# EasyEDA Pro project ProPrj_ArpiGlasses_Final2_2025-06-16.epro, schematic ArpiGlasses
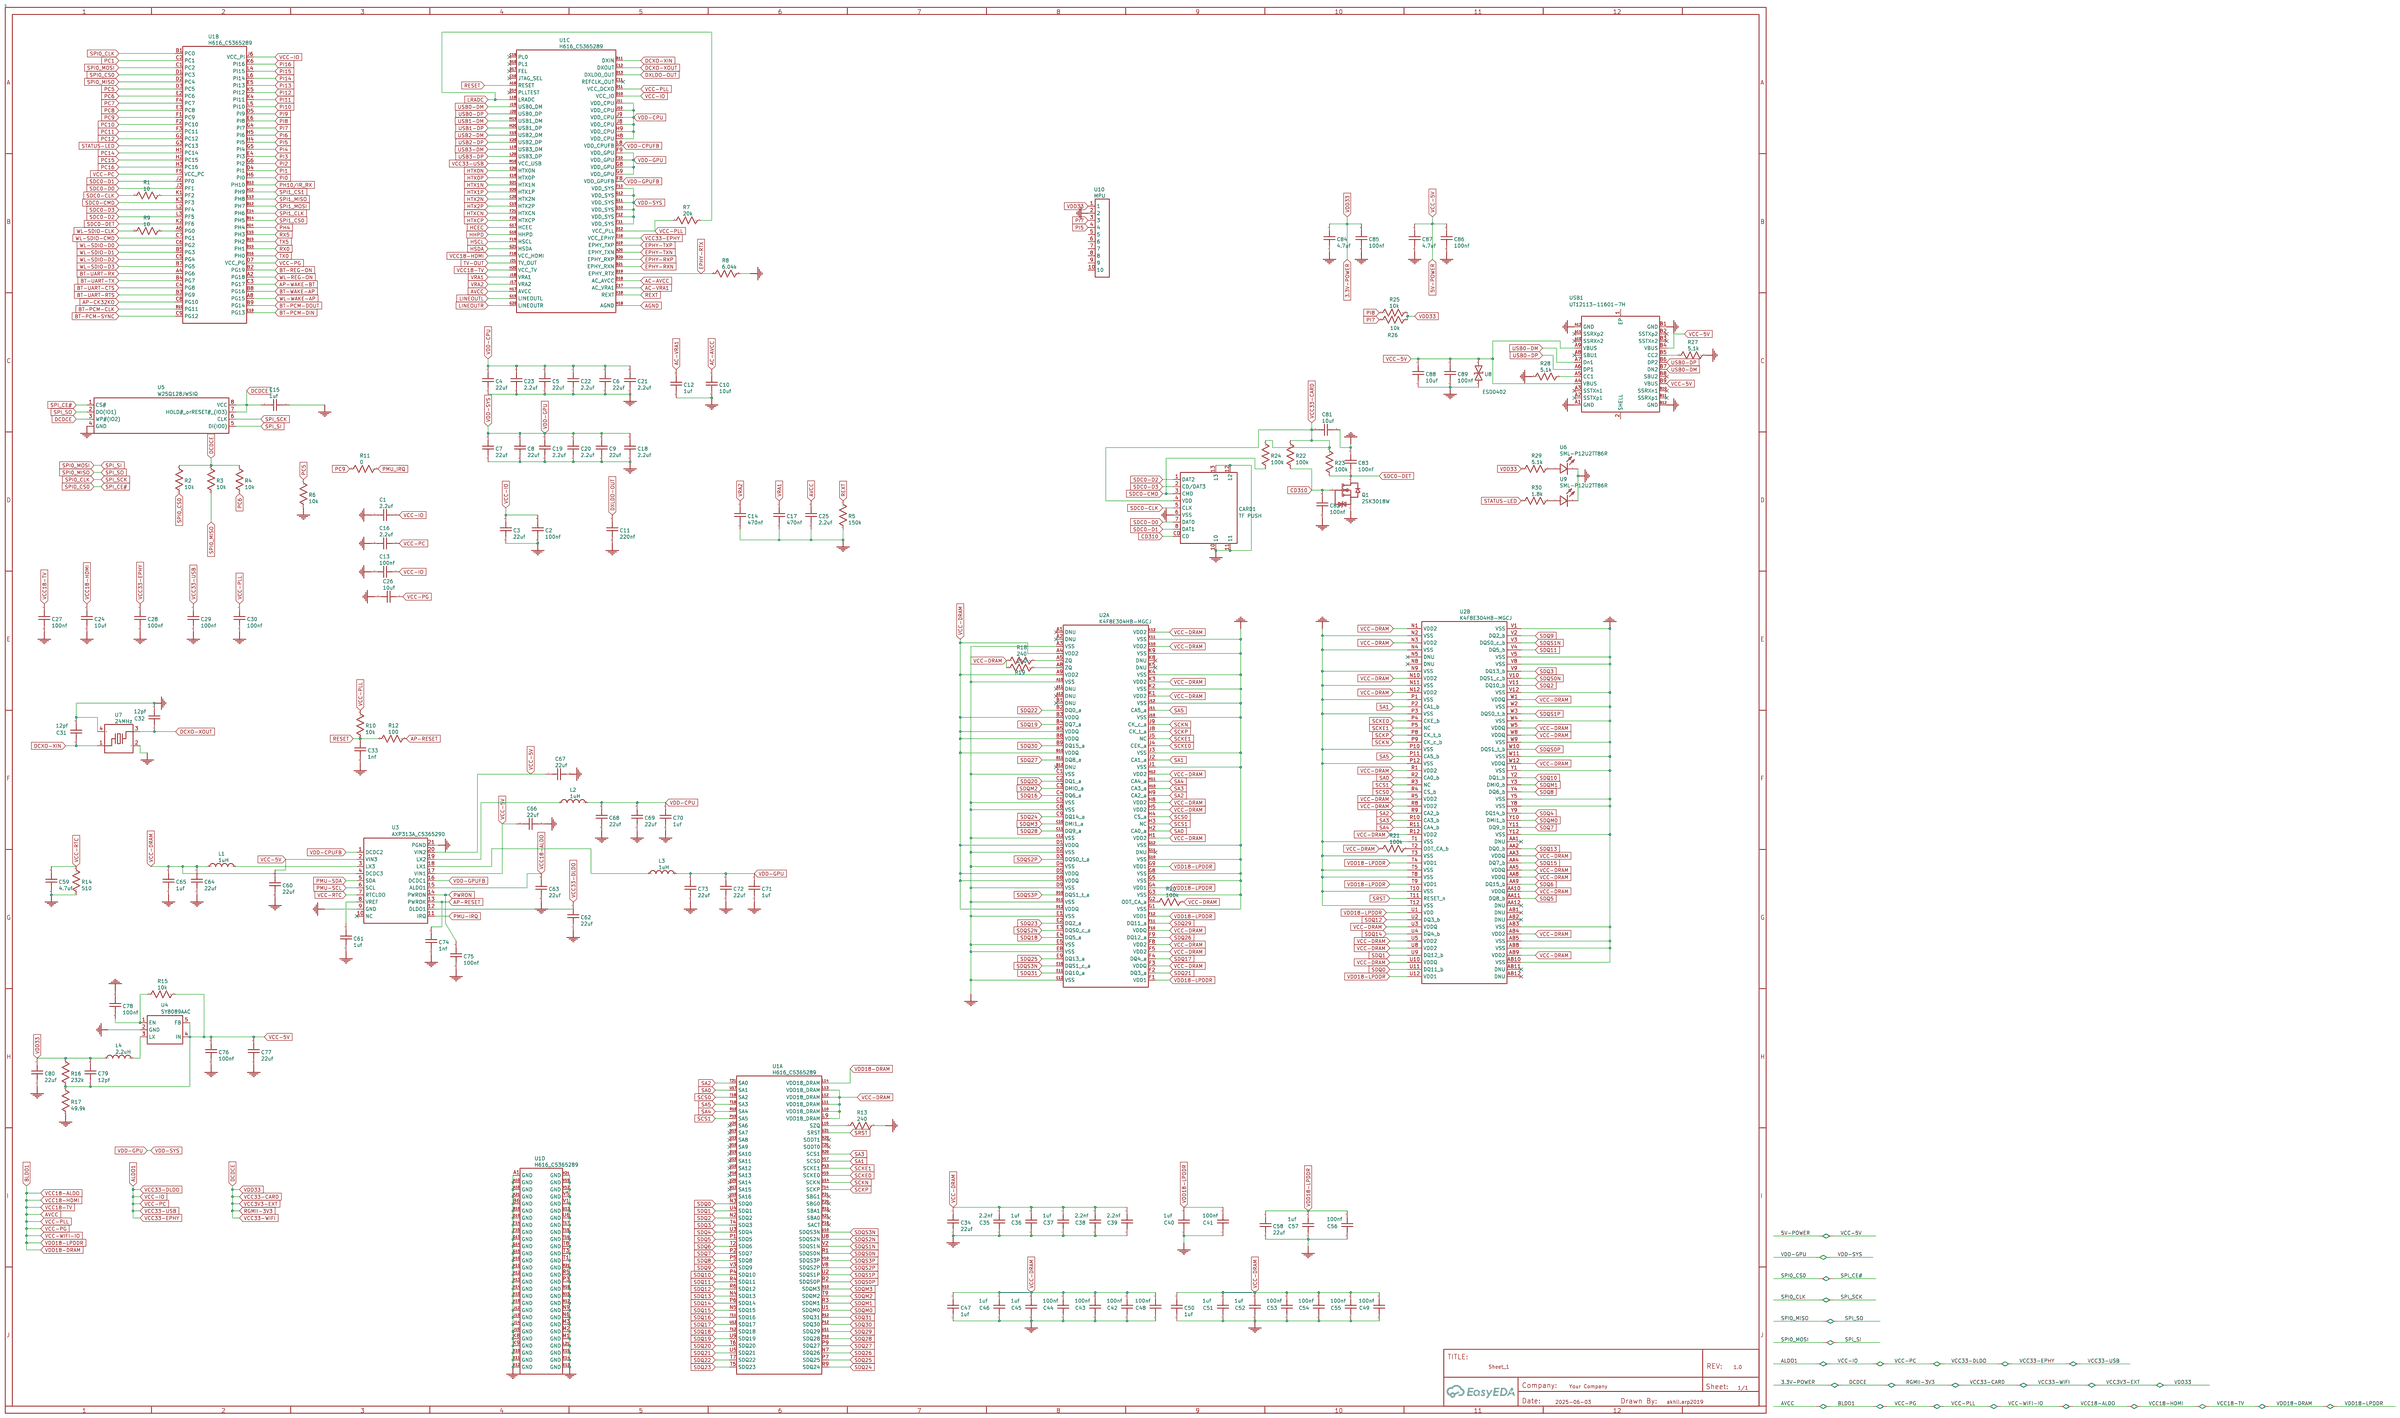
[diagram p0: schematic sheet]

## Parts
C1  2.2uf  [C0603]
C2  100nf  [C0603]
C3  22uf  [C0603]
C4  22uf  [C0603]
C5  22uf  [C0603]
C6  22uf  [C0603]
C7  22uf  [C0603]
C8  22uf  [C0603]
C9  22uf  [C0603]
C10  10uf  [C0603]
C11  220nf  [C0603]
C12  1uf  [C0603]
C13  100nf  [C0603]
C14  470nf  [C0603]
C15  1uf  [C0603]
C16  2.2uf  [C0603]
C17  470nf  [C0603]
C18  2.2uf  [C0603]
C19  2.2uf  [C0603]
C20  2.2uf  [C0603]
C21  2.2uf  [C0603]
C22  2.2uf  [C0603]
C23  2.2uf  [C0603]
C24  10uf  [C0603]
C25  2.2uf  [C0603]
C26  10uf  [C0603]
C27  100nf  [C0603]
C28  100nf  [C0603]
C29  100nf  [C0603]
C30  100nf  [C0603]
C31  12pf  [C0603]
C32  12pf  [C0603]
C33  1nf  [C0603]
C34  22uf  [C0603]
C35  2.2nf  [C0603]
C36  1uf  [C0603]
C37  1uf  [C0603]
C38  2.2nf  [C0603]
C39  2.2nf  [C0603]
C40  1uf  [C0603]
C41  100nf  [C0603]
C42  100nf  [C0603]
C43  100nf  [C0603]
C44  100nf  [C0603]
C45  1uf  [C0603]
C46  1uf  [C0603]
C47  1uf  [C0603]
C48  100nf  [C0603]
C49  100nf  [C0603]
C50  1uf  [C0603]
C51  1uf  [C0603]
C52  1uf  [C0603]
C53  100nf  [C0603]
C54  100nf  [C0603]
C55  100nf  [C0603]
C56  100nf  [C0603]
C57  1uf  [C0603]
C58  22uf  [C0603]
C59  4.7uf  [C0603]
C60  22uf  [C0603]
C61  1uf  [C0603]
C62  22uf  [C0603]
C63  22uf  [C0603]
C64  22uf  [C0603]
C65  1uf  [C0603]
C66  22uf  [C0603]
C67  22uf  [C0603]
C68  22uf  [C0603]
C69  22uf  [C0603]
C70  1uf  [C0603]
C71  1uf  [C0603]
C72  22uf  [C0603]
C73  22uf  [C0603]
C74  1nf  [C0603]
C75  100nf  [C0603]
C76  100nf  [C0603]
C77  22uf  [C0603]
C78  100nf  [C0603]
C79  12pf  [C0603]
C80  22uf  [C0603]
C81  10uf  [C0603]
C82  100nf  [C0603]
C83  100nf  [C0603]
C84  4.7uf  [C0603]
C85  100nf  [C0603]
C86  100nf  [C0603]
C87  4.7uf  [C0603]
C88  10uf  [C0603]
C89  100nf  [C0603]
CARD1  TF PUSH  [TF-SMD_TF-PUSH]
L1  1uH  [IND-SMD_L2.5-W2.0_AHP252010X]
L2  1uH  [IND-SMD_L2.5-W2.0_AHP252010X]
L3  1uH  [IND-SMD_L2.5-W2.0_AHP252010X]
L4  2.2uH  [IND-SMD_L2.5-W2.0_WPN252012H]
Q1  2SK3018W  [SOT-323_L2.0-W1.3-P1.30-LS2.1-TR]
R1  10  [R0603]
R2  10k  [R0603]
R3  10k  [R0603]
R4  10k  [R0603]
R5  150k  [R0603]
R6  10k  [R0603]
R7  20k  [R0603]
R8  6.04k  [R0603]
R9  10  [R0603]
R10  10k  [R0603]
R11  0  [R0603]
R12  100  [R0603]
R13  240  [R0603]
R14  510  [R0603]
R15  10k  [R0603]
R16  232k  [R0603]
R17  49.9k  [R0603]
R18  240  [R0603]
R19  240  [R0603]
R20  100k  [R0603]
R21  100k  [R0603]
R22  100k  [R0603]
R23  100k  [R0603]
R24  100k  [R0603]
R25  10k  [R0603]
R26  10k  [R0603]
R27  5.1k  [R0603]
R28  5.1k  [R0603]
R29  5.1k  [R0603]
R30  1.8k  [R0603]
U1  H616_C5365289  [BGA-284_L14.0-W12.0-P0.65-TL]  (sections 1,2,3,4)
U2  K4F8E304HB-MGCJ  [BGA-200_L15.0-W10.0_K4F8E304HB-MGCJ]  (sections 1,2)
U3  AXP313A_C5365290  [QFN-20_L3.0-W3.0-P0.40-BL-EP1.7]
U4  SY8089AAC  [SOT-23-5_L2.9-W1.6-P0.95-LS2.8-BL]
U5  W25Q128JWSIQ  [SOIC-8_L5.3-W5.3-P1.27-LS8.0-BL]
U6  SML-P12U2TT86R  [LED0402-R-RD]
U7  24MHz  [CRYSTAL-SMD_4P-L2.0-W1.6-BL-2]
U8  ESD0402  [D0402-BI]
U9  SML-P12U2TT86R  [LED0402-R-RD]
U10  MPU  [PIN HEADER 1X10PIN 2.54MM 10P]
USB1  UT12113-11601-7H  [USB-C-SMD_UT12113-11601-7H]

## Library data of the parts
C1 C16 C18-C23 C25 = 2.2uf: nameAlias: Value(F); Contributor: LCEDA_Lib; spicePre: C; spiceSymbolName: C_0603_US
C2 C13 C27-C30 C41-C44 C48 C49 C53-C56 C75 C76 C78 C82 C83 C85 C86 C89 = 100nf: nameAlias: Value(F); Contributor: LCEDA_Lib; spicePre: C; spiceSymbolName: C_0603_US
C3-C9 C34 C58 C60 C62-C64 C66-C69 C72 C73 C77 C80 = 22uf: nameAlias: Value(F); Contributor: LCEDA_Lib; spicePre: C; spiceSymbolName: C_0603_US
C10 C24 C26 C81 C88 = 10uf: nameAlias: Value(F); Contributor: LCEDA_Lib; spicePre: C; spiceSymbolName: C_0603_US
C11 = 220nf: nameAlias: Value(F); Contributor: LCEDA_Lib; spicePre: C; spiceSymbolName: C_0603_US
C12 C15 C36 C37 C40 C45-C47 C50-C52 C57 C61 C65 C70 C71 = 1uf: nameAlias: Value(F); Contributor: LCEDA_Lib; spicePre: C; spiceSymbolName: C_0603_US
C14 C17 = 470nf: nameAlias: Value(F); Contributor: LCEDA_Lib; spicePre: C; spiceSymbolName: C_0603_US
C31 C32 C79 = 12pf: nameAlias: Value(F); Contributor: LCEDA_Lib; spicePre: C; spiceSymbolName: C_0603_US
C33 C74 = 1nf: nameAlias: Value(F); Contributor: LCEDA_Lib; spicePre: C; spiceSymbolName: C_0603_US
C35 C38 C39 = 2.2nf: nameAlias: Value(F); Contributor: LCEDA_Lib; spicePre: C; spiceSymbolName: C_0603_US
C59 C84 C87 = 4.7uf: nameAlias: Value(F); Contributor: LCEDA_Lib; spicePre: C; spiceSymbolName: C_0603_US
CARD1 = TF PUSH: Supplier: LCSC; Supplier Part: C393941; Manufacturer: SHOU HAN(首韩); JLCPCB Part Class: Extended Part; Contributor: LCSC; spicePre: C
L1-L3 = 1uH: Supplier: LCSC; Manufacturer: Sunlord(顺络); Manufacturer Part: SWPA252012S1R0MT; Supplier Part: C66001; JLCPCB Part Class: Extended Part; nameAlias: Value; spicePre: L; spiceSymbolName: SWPA252012S1R0MT
L4 = 2.2uH: Supplier: LCSC; Manufacturer: Sunlord(顺络); Manufacturer Part: WPN252012H2R2MT; Supplier Part: C98350; JLCPCB Part Class: Extended Part; nameAlias: Value; spicePre: L; spiceSymbolName: WPN252012H2R2MT
Q1 = 2SK3018W: Supplier: LCSC; Supplier Part: C328614; Manufacturer: BLUE ROCKET(蓝箭); JLCPCB Part Class: Extended Part; Contributor: LCSC; spicePre: Q
R1 R9 = 10: nameAlias: Value(Ω); Contributor: LCEDA_Lib; spicePre: R; spiceSymbolName: R_0603_US
R2-R4 R6 R10 R15 R25 R26 = 10k: nameAlias: Value(Ω); Contributor: LCEDA_Lib; spicePre: R; spiceSymbolName: R_0603_US
R5 = 150k: nameAlias: Value(Ω); Contributor: LCEDA_Lib; spicePre: R; spiceSymbolName: R_0603_US
R7 = 20k: nameAlias: Value(Ω); Contributor: LCEDA_Lib; spicePre: R; spiceSymbolName: R_0603_US
R8 = 6.04k: nameAlias: Value(Ω); Contributor: LCEDA_Lib; spicePre: R; spiceSymbolName: R_0603_US
R11 = 0: nameAlias: Value(Ω); Contributor: LCEDA_Lib; spicePre: R; spiceSymbolName: R_0603_US
R12 = 100: nameAlias: Value(Ω); Contributor: LCEDA_Lib; spicePre: R; spiceSymbolName: R_0603_US
R13 R18 R19 = 240: nameAlias: Value(Ω); Contributor: LCEDA_Lib; spicePre: R; spiceSymbolName: R_0603_US
R14 = 510: nameAlias: Value(Ω); Contributor: LCEDA_Lib; spicePre: R; spiceSymbolName: R_0603_US
R16 = 232k: nameAlias: Value(Ω); Contributor: LCEDA_Lib; spicePre: R; spiceSymbolName: R_0603_US
R17 = 49.9k: nameAlias: Value(Ω); Contributor: LCEDA_Lib; spicePre: R; spiceSymbolName: R_0603_US
R20-R24 = 100k: nameAlias: Value(Ω); Contributor: LCEDA_Lib; spicePre: R; spiceSymbolName: R_0603_US
R27-R29 = 5.1k: nameAlias: Value(Ω); Contributor: LCEDA_Lib; spicePre: R; spiceSymbolName: R_0603_US
R30 = 1.8k: nameAlias: Value(Ω); Contributor: LCEDA_Lib; spicePre: R; spiceSymbolName: R_0603_US
U1 = H616_C5365289: Supplier: LCSC; Supplier Part: C5365289; Manufacturer: Allwinner(全志); Manufacturer Part: H616; JLCPCB Part Class: Extended Part; subpart_no: 1; spicePre: U
U2 = K4F8E304HB-MGCJ: Supplier: LCSC; Supplier Part: C2803257; Manufacturer: SAMSUNG(三星半导体); JLCPCB Part Class: Extended Part; subpart_no: 1; spicePre: U
U3 = AXP313A_C5365290: Supplier: LCSC; Supplier Part: C5365290; Manufacturer: x-powers; Manufacturer Part: AXP313A; JLCPCB Part Class: Extended Part; Contributor: lcsc; spicePre: U
U4 = SY8089AAC: Supplier: LCSC; Supplier Part: C5187495; Manufacturer: null; JLCPCB Part Class: Extended Part; Contributor: lcsc; spicePre: U
U5 = W25Q128JWSIQ: Supplier: LCSC; Supplier Part: C2763561; Manufacturer: WINBOND(华邦); JLCPCB Part Class: Extended Part; Contributor: LCSC; spicePre: U
U6 U9 = SML-P12U2TT86R: Supplier: LCSC; Supplier Part: C5336694; Manufacturer: ROHM(罗姆); JLCPCB Part Class: Extended Part; Contributor: lcsc; spicePre: U
U7 = 24MHz: Supplier: LCSC; Supplier Part: C5181486; Manufacturer: SST(索斯特); Manufacturer Part: 2016 24M 12PF 10PPM; JLCPCB Part Class: Extended Part; Contributor: lcsc; nameAlias: Value; spicePre: U; spiceSymbolName: 2016 24M 12PF 10PPM
U8 = ESD0402: Supplier: LCSC; Supplier Part: C9900022568; Manufacturer: null; JLCPCB Part Class: Extended Part; Contributor: lcsc; spicePre: U
U10 = MPU: Contributor: FirstZ Kai Zen; spicePre: U; spiceSymbolName: Pin Header 1x10Pin 2.54mm 10P
USB1 = UT12113-11601-7H: Supplier: LCSC; Supplier Part: C2761409; Manufacturer: FOXCONN(富士康); JLCPCB Part Class: Extended Part; Contributor: LCSC; spicePre: U

## Nets
3.3V-POWER: C15.2 C79.2 C80.2 C81.1 C84.2 C85.2 CARD1.4(VDD) L4.1 R2.2 R3.2 R4.2 R16.2 R22.2 R23.2 R24.2 R25.2 R26.2 R29.1 U5.3(WP#(IO2)) U5.7(HOLD# orRESET# (IO3)) U5.8(VCC) U10.1
5V-POWER: C60.2 C66.1 C67.1 C76.2 C77.2 C79.1 C86.2 C87.2 C88.2 C89.2 R15.2 R16.1 R17.2 U3.2(VIN3) U3.17(VIN1) U3.20(VIN2) U4.4(IN) U4.5(FB) U8.1 USB1.A4(VBUS) USB1.A9(VBUS) USB1.B4(VBUS) USB1.B9(VBUS)
AGND: U1.H18(AGND)
AVCC: C24.2 C25.2 C26.1 C27.2 C30.2 C40.2 C41.2 C56.2 C57.2 C58.2 C63.2 R7.2 R10.2 U1.D7(VCC_PG) U1.D11(VCC_DCXO) U1.D12(VCC_PLL) U1.F18(VCC_HDMI) U1.H17(AVCC) U1.H20(VCC_TV) U1.L14(VDD18_DRAM) U2.F1(VDD1) U2.F12(VDD1) U2.G4(VDD1) U2.G9(VDD1) U2.T4(VDD1) U2.T9(VDD1) U2.U1(VDD) U2.U12(VDD1) U3.15(ALDO1)
GND: C1.2 C2.1 C3.1 C4.1 C5.1 C6.1 C7.1 C8.1 C9.1 C10.1 C11.1 C12.1 C13.2 C14.1 C15.1 C16.2 C17.1 C18.1 C19.1 C20.1 C21.1 C22.1 C23.1 C24.1 C25.1 C26.2 C27.1 C28.1 C29.1 C30.1 C31.2 C32.2 C33.1 C34.1 C35.1 C36.1 C37.1 C38.1 C39.1 C40.1 C41.1 C42.1 C43.1 C44.1 C45.1 C46.1 C47.1 C48.1 C49.1 C50.1 C51.1 C52.1 C53.1 C54.1 C55.1 C56.1 C57.1 C58.1 C59.1 C60.1 C61.1 C62.1 C63.1 C64.1 C65.1 C66.2 C67.2 C68.1 C69.1 C70.1 C71.1 C72.1 C73.1 C74.1 C75.1 C76.1 C77.1 C78.1 C80.1 C81.2 C82.1 C83.2 C84.1 C85.1 C86.1 C87.1 C88.1 C89.1 CARD1.6(VSS) CARD1.10 CARD1.11 CARD1.12 CARD1.13 Q1.1(S) R5.1 R6.1 R8.1 R13.2 R14.1 R17.1 R27.2 R28.2 U1.A1(GND) U1.A10(GND) U1.A18(GND) U1.A21(GND) U1.B6(GND) U1.B16(GND) U1.D19(GND) U1.F14(GND) U1.F15(GND) U1.G13(GND) U1.G14(GND) U1.G15(GND) U1.H10(GND) U1.H11(GND) U1.H12(GND) U1.H13(GND) U1.H14(GND) U1.H15(GND) U1.H19(GND) U1.J12(GND) U1.J13(GND) U1.J14(GND) U1.J15(GND) U1.K8(GND) U1.K9(GND) U1.K10(GND) U1.K11(GND) U1.K12(GND) U1.K13(GND) U1.K14(GND) U1.K15(GND) U1.L21(GND) U1.M1(GND) U1.M2(GND) U1.M3(GND) U1.N6(GND) U1.N9(GND) U1.N12(GND) U1.N15(GND) U1.N18(GND) U1.P3(GND) U1.R5(GND) U1.R21(GND) U1.T1(GND) U1.T3(GND) U1.T8(GND) U1.T10(GND) U1.T15(GND) U1.T17(GND) U1.U6(GND) U1.U13(GND) U1.V1(GND) U1.V5(GND) U1.V12(GND) U1.V19(GND) U1.V21(GND) U2.A3(VSS) U2.A10(VSS) U2.AB3(VSS) U2.AB5(VSS) U2.AB8(VSS) U2.AB10(VSS) U2.C1(VSS) U2.C5(VSS) U2.C8(VSS) U2.C12(VSS) U2.D2(VSS) U2.D4(VSS) U2.D9(VSS) U2.D11(VSS) U2.E1(VSS) U2.E5(VSS) U2.E8(VSS) U2.E12(VSS) U2.G1(VSS) U2.G3(VSS) U2.G5(VSS) U2.G8(VSS) U2.G10(VSS) U2.G12(VSS) U2.J1(VSS) U2.J3(VSS) U2.J10(VSS) U2.J12(VSS) U2.K2(VSS) U2.K4(VSS) U2.K9(VSS) U2.K11(VSS) U2.N2(VSS) U2.N4(VSS) U2.N9(VSS) U2.N11(VSS) U2.P1(VSS) U2.P3(VSS) U2.P10(VSS) U2.P12(VSS) U2.T1(VSS) U2.T3(VSS) U2.T5(VSS) U2.T8(VSS) U2.T10(VSS) U2.T12(VSS) U2.V1(VSS) U2.V5(VSS) U2.V8(VSS) U2.V12(VSS) U2.W2(VSS) U2.W4(VSS) U2.W9(VSS) U2.W11(VSS) U2.Y1(VSS) U2.Y5(VSS) U2.Y8(VSS) U2.Y12(VSS) U3.9(GND) U3.21(PGND) U4.2(GND) U5.4(GND) U6.2(C) U7.2(GND) U7.4(GND) U8.2 U9.2(C) U10.2 USB1.A1(GND) USB1.A12(GND) USB1.B1(GND) USB1.B12(GND)
VCC-DRAM: C34.2 C35.2 C36.2 C37.2 C38.2 C39.2 C42.2 C43.2 C44.2 C45.2 C46.2 C47.2 C48.2 C49.2 C50.2 C51.2 C52.2 C53.2 C54.2 C55.2 C64.2 C65.2 L1.1 R18.1 R19.1 R20.2 R21.1 U1.L9(VDD18_DRAM) U1.L10(VDD18_DRAM) U1.L11(VDD18_DRAM) U1.L12(VDD18_DRAM) U1.L13(VDD18_DRAM) U2.A4(VDD2) U2.A9(VDD2) U2.AA3(VDDQ) U2.AA5(VDDQ) U2.AA8(VDDQ) U2.AA10(VDDQ) U2.AB4(VDD2) U2.AB9(VDD2) U2.B3(VDDQ) U2.B5(VDDQ) U2.B8(VDDQ) U2.B10(VDDQ) U2.D1(VDDQ) U2.D5(VDDQ) U2.D8(VDDQ) U2.D12(VDDQ) U2.F3(VDDQ) U2.F5(VDD2) U2.F8(VDD2) U2.F10(VDDQ) U2.H1(VDD2) U2.H5(VDD2) U2.H8(VDD2) U2.H12(VDD2) U2.K1(VDD2) U2.K3(VDD2) U2.K10(VDD2) U2.K12(VDD2) U2.N1(VDD2) U2.N3(VDD2) U2.N10(VDD2) U2.N12(VDD2) U2.R1(VDD2) U2.R5(VDD2) U2.R8(VDD2) U2.R12(VDD2) U2.U3(VDDQ) U2.U5(VDD2) U2.U8(VDD2) U2.U10(VDDQ) U2.W1(VDDQ) U2.W5(VDDQ) U2.W8(VDDQ) U2.W12(VDDQ) U3.4(DCDC3)
VCC-RTC: C59.2 R14.2 U3.7(RTCLDO)
VDD-CPU: C4.2 C5.2 C6.2 C21.2 C22.2 C23.2 C68.2 C69.2 C70.2 L2.2 U1.H8(VDD_CPU) U1.H9(VDD_CPU) U1.J8(VDD_CPU) U1.J9(VDD_CPU) U1.J10(VDD_CPU) U1.J11(VDD_CPU)
VDD-CPUFB: U1.L8(VDD_CPUFB) U3.1(DCDC2)
VDD-GPU: C7.2 C8.2 C9.2 C18.2 C19.2 C20.2 C71.2 C72.2 C73.2 L3.2 U1.F9(VDD_GPU) U1.F10(VDD_GPU) U1.F11(VDD_SYS) U1.F12(VDD_SYS) U1.F13(VDD_SYS) U1.G8(VDD_GPU) U1.G9(VDD_GPU) U1.G10(VDD_SYS) U1.G11(VDD_SYS) U1.G12(VDD_SYS)
VDD-GPUFB: U1.F8(VDD_GPUFB) U3.16(DCDC1)
AC-AVCC: C10.2 U1.D18(AC_AVCC)
AC-VRA1: C12.2 U1.C17(AC_VRA1)
ALDO1: C1.1 C2.2 C3.2 C13.1 C16.1 C28.2 C29.2 C62.2 U1.D10(VCC_IO) U1.E18(VCC_EPHY) U1.F5(VCC_PC) U1.J6(VCC_PI) U1.M18(VCC_USB) U3.12(DLDO1)
AP-CK32KO: U1.C8(PG10)
AP-RESET: C74.2 R12.2 U3.13(PWROK)
AP-WAKE-BT: U1.C3(PG17)
BT-PCM-CLK: U1.B10(PG11)
BT-PCM-DIN: U1.C10(PG13)
BT-PCM-DOUT: U1.B9(PG14)
BT-PCM-SYNC: U1.C9(PG12)
BT-REG-ON: U1.B2(PG19)
BT-UART-CTS: U1.C4(PG8)
BT-UART-RTS: U1.B3(PG9)
BT-UART-RX: U1.A4(PG6)
BT-UART-TX: U1.B4(PG7)
BT-WAKE-AP: U1.B8(PG16)
CD310: C82.2 CARD1.CD Q1.2(G) R22.1
DCXO-XIN: C31.1 U1.B11(DXIN) U7.1
DCXO-XOUT: C32.1 U1.C12(DXOUT) U7.3
DXLDO-OUT: C11.2 U1.D13(DXLDO_OUT)
EPHY-RTX: R8.2 U1.B19(EPHY_RTX)
EPHY-RXN: U1.B21(EPHY_RXN)
EPHY-RXP: U1.B20(EPHY_RXP)
EPHY-TXN: U1.A20(EPHY_TXN)
EPHY-TXP: U1.A19(EPHY_TXP)
HCEC: U1.G17(HCEC)
HHPD: U1.G18(HHPD)
HSCL: U1.F19(HSCL)
HSDA: U1.G21(HSDA)
HTX0N: U1.E20(HTX0N)
HTX0P: U1.E19(HTX0P)
HTX1N: U1.D21(HTX1N)
HTX1P: U1.D20(HTX1P)
HTX2N: U1.C20(HTX2N)
HTX2P: U1.C19(HTX2P)
HTXCN: U1.F21(HTXCN)
HTXCP: U1.F20(HTXCP)
LINEOUTL: U1.G19(LINEOUTL)
LINEOUTR: U1.G20(LINEOUTR)
LRADC: R7.1 U1.L18(LRADC)
PC1: U1.C2(PC1)
PC5: R6.2 U1.D3(PC5)
PC6: R4.1 U1.E2(PC6)
PC7: U1.F4(PC7)
PC8: U1.E3(PC8)
PC9: R11.1 U1.F1(PC9)
PC10: U1.F2(PC10)
PC11: U1.F3(PC11)
PC12: U1.G2(PC12)
PC14: U1.H1(PC14)
PC15: U1.H2(PC15)
PC16: U1.H3(PC16)
PH4: U1.A14(PH4)
PH10/IR_RX: U1.B13(PH10)
PI0: U1.H6(PI0)
PI1: U1.D4(PI1)
PI2: U1.G6(PI2)
PI3: U1.E4(PI3)
PI4: U1.G5(PI4)
PI5: U1.H4(PI5) U10.4
PI6: U1.H5(PI6)
PI7: R26.1 U1.G4(PI7) U10.3
PI8: R25.1 U1.E6(PI8)
PI9: U1.D5(PI9)
PI10: U1.L5(PI10)
PI11: U1.K4(PI11)
PI12: U1.K5(PI12)
PI13: U1.E5(PI13)
PI14: U1.L6(PI14)
PI15: U1.L4(PI15)
PI16: U1.K6(PI16)
PMU-IRQ: U3.11(IRQ)
PMU-SCL: U3.6(SCL)
PMU-SDA: U3.5(SDA)
PMU_IRQ: R11.2
PWRON: C75.2 U3.14(PWRON)
RESET: R10.1 R12.1 U1.A16(RESET)
REXT: R5.2 U1.K18(REXT)
RX0: U1.D15(PH1)
RX5: U1.C15(PH3)
SA0: U1.U17(SA1) U2.H2(CA0_a) U2.R2(CA0_b)
SA1: U1.V17(SCS0) U2.J2(CA1_a) U2.P2(CA1_b)
SA2: U1.T21(SA0) U2.H9(CA2_a) U2.R9(CA2_b)
SA3: U1.R20(SCS1) U2.H10(CA3_a) U2.R10(CA3_b)
SA4: U1.R18(SA4) U2.H11(CA4_a) U2.R11(CA4_b)
SA5: U1.T16(SA3) U2.J11(CA5_a) U2.P11(CA5_b)
SCKE0: U1.V15(SCKE0) U2.J4(CEK_a) U2.P4(CKE_b)
SCKE1: U1.P13(SCKE1) U2.J5(NC) U2.P5(NC)
SCKN: U1.U14(SCKN) U2.J9(CK_c_a) U2.P9(CK_c_b)
SCKP: U1.T14(SCKP) U2.J8(CK_t_a) U2.P8(CK_t_b)
SCS0: U1.T18(SA2) U2.H4(CS_a) U2.R4(CS_b)
SCS1: U1.P15(SA5) U2.H3(NC) U2.R3(NC)
SDC0-CLK: CARD1.5(CLX) R1.2
SDC0-CMD: CARD1.3(CMD) R24.1 U1.K3(PF3)
SDC0-D0: CARD1.7(DAT0) U1.J3(PF1)
SDC0-D1: CARD1.8(DAT1) U1.J2(PF0)
SDC0-D2: CARD1.1(DAT2) U1.L3(PF5)
SDC0-D3: CARD1.2(CD/DAT3) U1.L2(PF4)
SDC0-DET: C83.1 Q1.3(D) R23.1 U1.K2(PF6)
SDQ0: U1.N3(SDQ0) U2.U11(DQ11_b)
SDQ1: U1.U4(SDQ1) U2.U9(DQ12_b)
SDQ2: U1.N2(SDQ2) U2.V11(DQ10_b)
SDQ3: U1.T4(SDQ3) U2.V9(DQ13_b)
SDQ4: U1.U3(SDQ4) U2.Y9(DQ14_b)
SDQ5: U1.P1(SDQ5) U2.AA11(DQ8_b)
SDQ6: U1.T2(SDQ6) U2.AA9(DQ15_b)
SDQ7: U1.P2(SDQ7) U2.Y11(DQ9_b)
SDQ8: U1.P5(SDQ8) U2.Y4(DQ6_b)
SDQ9: U1.V3(SDQ9) U2.V2(DQ2_b)
SDQ10: U1.P4(SDQ10) U2.Y2(DQ1_b)
SDQ11: U1.R4(SDQ11) U2.V4(DQ5_b)
SDQ12: U1.R6(SDQ12) U2.U2(DQ3_b)
SDQ13: U1.N4(SDQ13) U2.AA2(DQ0_b)
SDQ14: U1.P6(SDQ14) U2.U4(DQ4_b)
SDQ15: U1.N5(SDQ15) U2.AA4(DQ7_b)
SDQ16: U1.T11(SDQ16) U2.C4(DQ6_a)
SDQ17: U1.U12(SDQ17) U2.F4(DQ4_a)
SDQ18: U1.T12(SDQ18) U2.E4(DQ5_a)
SDQ19: U1.U9(SDQ19) U2.B4(DQ7_a)
SDQ20: U1.T6(SDQ20) U2.C2(DQ1_a)
SDQ21: U1.U5(SDQ21) U2.F2(DQ3_a)
SDQ22: U1.T7(SDQ22) U2.B2(DQ0_a)
SDQ23: U1.T5(SDQ23) U2.E2(DQ2_a)
SDQ24: U1.R9(SDQ24) U2.C9(DQ14_a)
SDQ25: U1.P7(SDQ25) U2.E9(DQ13_a)
SDQ26: U1.N7(SDQ26) U2.F9(DQ12_a)
SDQ27: U1.P9(SDQ27) U2.B11(DQ8_a)
SDQ28: U1.P10(SDQ28) U2.C11(DQ9_a)
SDQ29: U1.U11(SDQ29) U2.F11(DQ11_a)
SDQ30: U1.P12(SDQ30) U2.B9(DQ15_a)
SDQ31: U1.R12(SDQ31) U2.E11(DQ10_a)
SDQM0: U1.U1(SDQM0) U2.Y10(DMI1_b)
SDQM1: U1.R3(SDQM1) U2.Y3(DMI0_b)
SDQM2: U1.T9(SDQM2) U2.C3(DMIO_a)
SDQM3: U1.N10(SDQM3) U2.C10(DMI1_a)
SDQS0N: U1.R1(SDQS0N) U2.V10(DQS1_c_b)
SDQS0P: U1.R2(SDQS0P) U2.W10(DQS1_t_b)
SDQS1N: U1.V2(SDQS1N) U2.V3(DQS0_c_b)
SDQS1P: U1.U2(SDQS1P) U2.W3(DQS0_t_b)
SDQS2N: U1.U8(SDQS2N) U2.E3(DQS0_c_a)
SDQS2P: U1.V8(SDQS2P) U2.D3(DQS0_t_a)
SDQS3N: U1.U10(SDQS3N) U2.E10(DQS1_c_a)
SDQS3P: U1.V10(SDQS3P) U2.D10(DQS1_t_a)
SPI0_CLK: U1.B1(PC0) U5.6(CLK)
SPI0_CS0: R2.1 U1.D1(PC3) U5.1(CS#)
SPI0_MISO: R3.1 U1.D2(PC4) U5.2(DO(IO1))
SPI0_MOSI: U1.C1(PC2) U5.5(DI(IO0))
SPI1_CLK: U1.C14(PH6)
SPI1_CS0: U1.B14(PH5)
SPI1_CS1: U1.A12(PH9)
SPI1_MISO: U1.C13(PH8)
SPI1_MOSI: U1.B12(PH7)
SRST: U1.U21(SRST) U2.T11(RESET_n)
STATUS-LED: R30.1 U1.G3(PC13)
TV-OUT: U1.J21(TV_OUT)
TX0: U1.D16(PH0)
TX5: U1.B15(PH2)
USB0-DM: U1.J19(USB0_DM) USB1.A7(Dn1) USB1.B7(DN2)
USB0-DP: U1.J20(USB0_DP) USB1.A6(DP1) USB1.B6(DP2)
USB1-DM: U1.M19(USB1_DM)
USB1-DP: U1.M20(USB1_DP)
USB2-DM: U1.K19(USB2_DM)
USB2-DP: U1.K20(USB2_DP)
USB3-DM: U1.L19(USB3_DM)
USB3-DP: U1.L20(USB3_DP)
VRA1: C17.2 U1.J18(VRA1)
VRA2: C14.2 U1.J17(VRA2)
WL-REG-ON: U1.A2(PG18)
WL-SDIO-CLK: R9.2
WL-SDIO-CMD: U1.C7(PG1)
WL-SDIO-D0: U1.C6(PG2)
WL-SDIO-D1: U1.B5(PG3)
WL-SDIO-D2: U1.C5(PG4)
WL-SDIO-D3: U1.B7(PG5)
WL-WAKE-AP: U1.A8(PG15)
U1_A6: R9.1 U1.A6(PG0)
U1_K1: R1.1 U1.K1(PF2)
U1_L15: R13.1 U1.L15(SZQ)
U2_A5: R18.2 U2.A5(ZQ)
U2_A8: R19.2 U2.A8(ZQ)
U2_G2: R20.1 U2.G2(ODT_CA_a)
U2_T2: R21.2 U2.T2(ODT_CA_b)
U3_3: L1.2 U3.3(LX3)
U3_8: C61.2 U3.8(VREF)
U3_18: L3.1 U3.18(LX1)
U3_19: L2.1 U3.19(LX2)
U4_1: C78.2 R15.1 U4.1(EN)
U4_3: L4.2 U4.3(LX)
U6_1: R29.2 U6.1(A)
U9_1: R30.2 U9.1(A)
USB1_A5: R28.1 USB1.A5(CC1)
USB1_B5: R27.1 USB1.B5(CC2)

Not connected (* = marked no-connect by the designer): C33 2; U1 B17(FEL)* B18(PL1)* C11(REFCLK_OUT)* C16(JTAG_SEL)* C18(PL0)* D14(PLLTEST)* N13(SA15)* N16(SA9)* N19(SA7)* N20(SODT1)* N21(SBA0)* P16(SA13)* P18(SACT)* P20(SBG0)* P21(SBG1)* R15(SBA1)* R19(SA10)* T20(SODT0)* U15(SA11)* U16(SA12)* U18(SA16)* U19(SA8)* U20(SA6)* V20(SA14)*; U2 A1(DNU)* A2(DNU)* A11(DNU)* A12(DNU)* AA1(DNU)* AA12(DNU)* AB1(DNU)* AB2(DNU)* AB11(DNU)* AB12(DNU)* B1(DNU)* B12(DNU)* G11(DNU)* K5(DNU)* K8(DNU)* N5(DNU)* N8(DNU)*; U3 10(NC)*; U10 5 6 7 8 9 10; USB1 1(EP) 2(SHELL) A2(SSTXp1)* A3(SSTXn1)* A8(SBU1)* A10(SSRXn2)* A11(SSRXp2)* B2(SSTXp2)* B3(SSTXn2)* B8(SBU2)* B10(SSRXn1)* B11(SSRXp1)*
